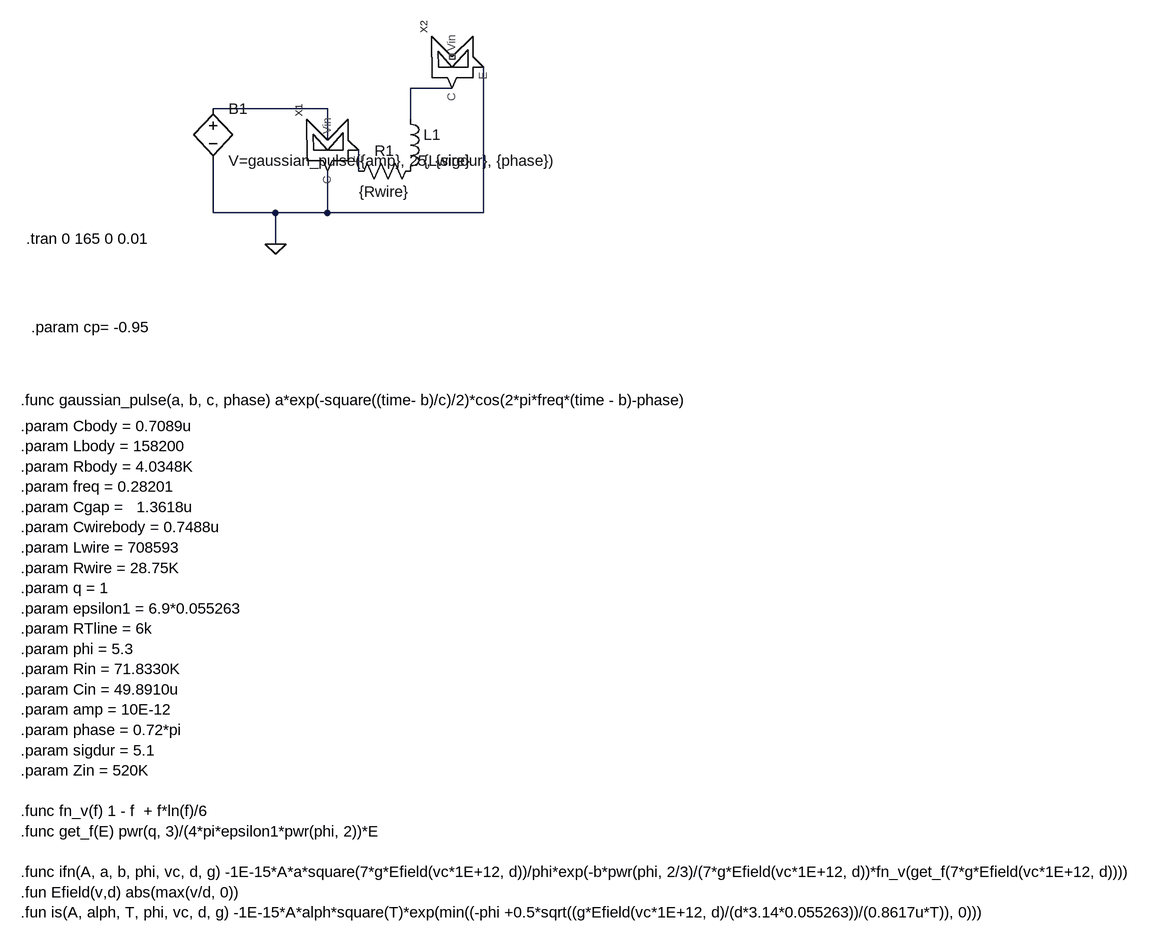
[diagram p0: schematic memcell_w_nanantennas.asc]
memcell_w_nanantennas.asc, the LTspice schematic file:
Version 4
SHEET 1 2092 1192
WIRE 768 -16 704 -16
WIRE 576 16 400 16
WIRE 704 32 704 -16
WIRE 576 64 576 16
WIRE 624 112 624 80
WIRE 400 176 400 96
WIRE 496 176 400 176
WIRE 576 176 576 112
WIRE 576 176 496 176
WIRE 816 176 816 -48
WIRE 816 176 576 176
WIRE 496 224 496 176
FLAG 496 224 0
SYMBOL nanoantenna_component 576 64 R270
SYMATTR InstName X1
SYMBOL nanoantenna_component 768 -64 R270
SYMATTR InstName X2
SYMBOL res 720 96 R90
WINDOW 0 0 56 VBottom 2
WINDOW 3 32 56 VTop 2
SYMATTR InstName R1
SYMATTR Value {Rwire}
SYMBOL ind 688 16 R0
SYMATTR InstName L1
SYMATTR Value {Lwire}
SYMBOL bv 400 0 R0
SYMATTR InstName B1
SYMATTR Value V=gaussian_pulse({amp}, 25, {sigdur}, {phase})
TEXT 112 216 Left 2 !.tran 0 165 0 0.01
TEXT 120 352 Left 2 !.param cp= -0.95
TEXT 104 464 Left 2 !.func gaussian_pulse(a, b, c, phase) a*exp(-square((time- b)/c)/2)*cos(2*pi*freq*(time - b)-phase)
TEXT 104 504 Left 2 !.param Cbody = 0.7089u\n.param Lbody = 158200\n.param Rbody = 4.0348K\n.param freq = 0.28201\n.param Cgap =   1.3618u\n.param Cwirebody = 0.7488u\n.param Lwire = 708593\n.param Rwire = 28.75K\n.param q = 1\n.param epsilon1 = 6.9*0.055263\n.param RTline = 6k\n.param phi = 5.3\n.param Rin = 71.8330K\n.param Cin = 49.8910u\n.param amp = 10E-12\n.param phase = 0.72*pi\n.param sigdur = 5.1\n.param Zin = 520K\n \n.func fn_v(f) 1 - f  + f*ln(f)/6\n.func get_f(E) pwr(q, 3)/(4*pi*epsilon1*pwr(phi, 2))*E\n \n.func ifn(A, a, b, phi, vc, d, g) -1E-15*A*a*square(7*g*Efield(vc*1E+12, d))/phi*exp(-b*pwr(phi, 2/3)/(7*g*Efield(vc*1E+12, d))*fn_v(get_f(7*g*Efield(vc*1E+12, d))))\n.fun Efield(v,d) abs(max(v/d, 0))\n.fun is(A, alph, T, phi, vc, d, g) -1E-15*A*alph*square(T)*exp(min((-phi +0.5*sqrt((g*Efield(vc*1E+12, d)/(d*3.14*0.055263))/(0.8617u*T)), 0)))

The netlist it stands for:
* memcell_w_nanantennas.asc
XX1 N002 N003 0 nanoantenna_component params: nanoantenna_component  ; pins Vin E C
XX2 NC_01 0 N001 nanoantenna_component params: nanoantenna_component  ; pins Vin E C
R1 P001 N003 {Rwire}
L1 N001 P001 {Lwire}
B1 N002 0 V=gaussian_pulse({amp}, 25, {sigdur}, {phase})
.tran 0 165 0 0.01
.param cp= -0.95
.func gaussian_pulse(a, b, c, phase) a*exp(-square((time- b)/c)/2)*cos(2*pi*freq*(time - b)-phase)
.param Cbody = 0.7089u
.param Lbody = 158200
.param Rbody = 4.0348K
.param freq = 0.28201
.param Cgap =   1.3618u
.param Cwirebody = 0.7488u
.param Lwire = 708593
.param Rwire = 28.75K
.param q = 1
.param epsilon1 = 6.9*0.055263
.param RTline = 6k
.param phi = 5.3
.param Rin = 71.8330K
.param Cin = 49.8910u
.param amp = 10E-12
.param phase = 0.72*pi
.param sigdur = 5.1
.param Zin = 520K
.func fn_v(f) 1 - f  + f*ln(f)/6
.func get_f(E) pwr(q, 3)/(4*pi*epsilon1*pwr(phi, 2))*E
.func ifn(A, a, b, phi, vc, d, g) -1E-15*A*a*square(7*g*Efield(vc*1E+12, d))/phi*exp(-b*pwr(phi, 2/3)/(7*g*Efield(vc*1E+12, d))*fn_v(get_f(7*g*Efield(vc*1E+12, d))))
.fun Efield(v,d) abs(max(v/d, 0))
.fun is(A, alph, T, phi, vc, d, g) -1E-15*A*alph*square(T)*exp(min((-phi +0.5*sqrt((g*Efield(vc*1E+12, d)/(d*3.14*0.055263))/(0.8617u*T)), 0)))
.backanno
.end